# EAGLE design schaltplan (EAGLE 7.7.0)
Schaltplan SensorknotenIoT Arduino Nano
CNAME: SensorknotenIoT Arduino Nano; CREVISION: 2.3; DESIGNER: Jan G. & David P.
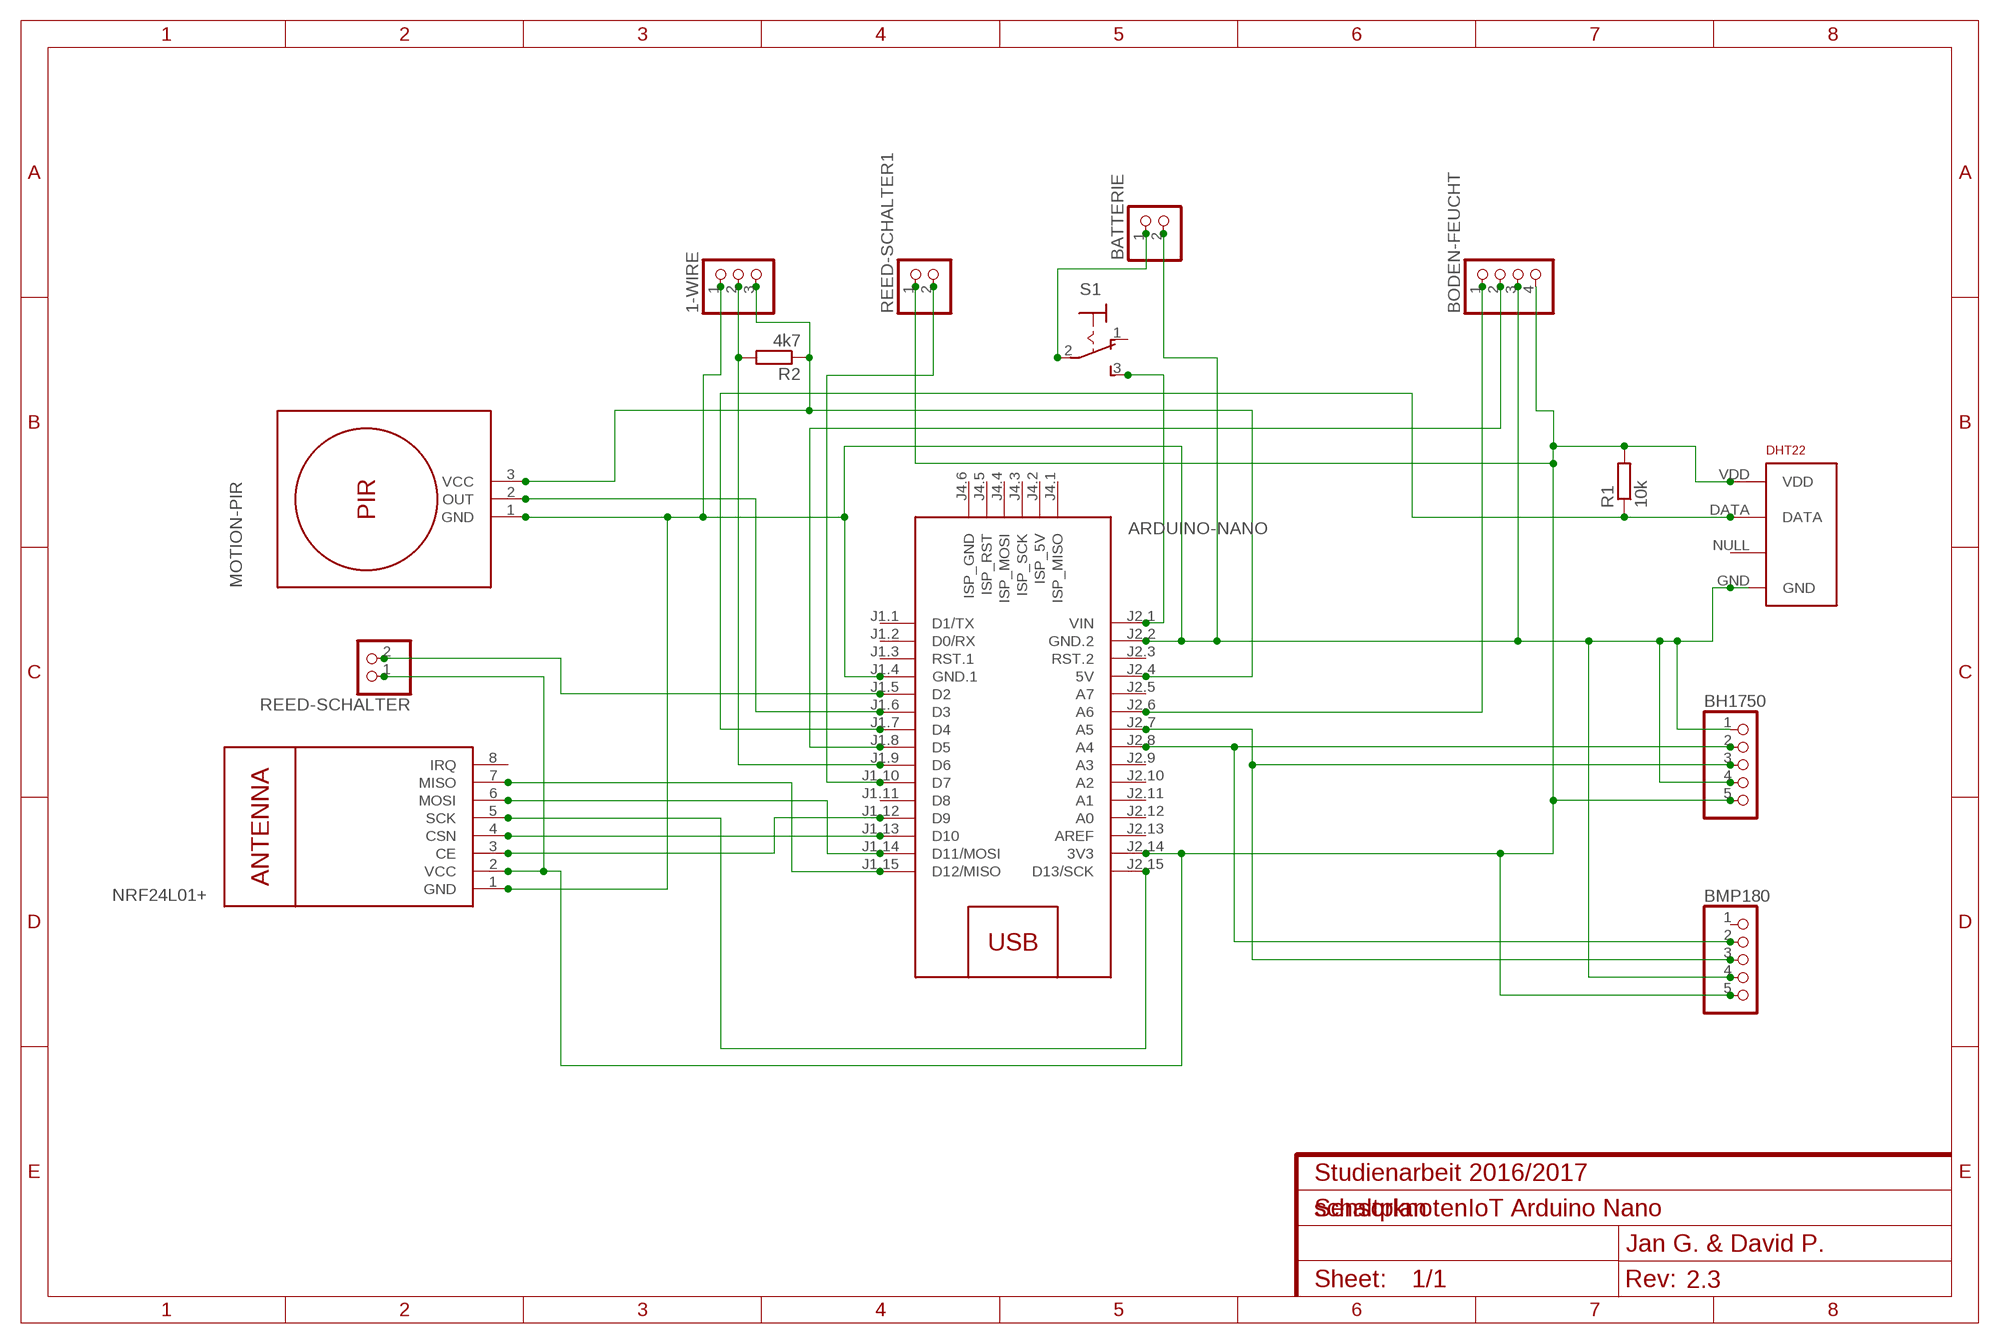
[diagram p0: schematic, sheet 1]

## Parts
1-WIRE  PINHD-1X3  [1X03]
ARDUINO-NANO  ARDUINO-NANO-3.0#ISP  [ARDUINO-NANO-3.0#ISP]
BATTERIE  PINHD-1X2  [1X02]
BH1750  PINHD-1X5  [1X05]
BMP180  PINHD-1X5  [1X05]
BODEN-FEUCHT  PINHD-1X4  [1X04]
DHT22  RHT03_DHT-22_AM2302  [RHT03_DHT-22]
MOTION-PIR  MOTION-PIR-DYP-ME003  [MOTION-PIR-DYP-ME003]
NRF24L01+  WIRELESS-NRF24L01  [WIRELESS-NRF24L01]
R1  10k  R-EU_0207/10  [0207/10]
R2  4k7  R-EU_0207/10  [0207/10]
REED-SCHALTER  PINHD-1X2  [1X02]
REED-SCHALTER1  PINHD-1X2  [1X02]
S1  320-916  [320-916]

## Nets
3.3V: ARDUINO-NANO.J2.14(3V3) BH1750.5 BMP180.5 BODEN-FEUCHT.4 DHT22.VDD NRF24L01+.2(VCC) R1.2 REED-SCHALTER1.1 REED-SCHALTER.1
5V: 1-WIRE.3 ARDUINO-NANO.J2.4(5V) MOTION-PIR.3(VCC) R2.1
GND: 1-WIRE.1 ARDUINO-NANO.J1.4(GND.1) ARDUINO-NANO.J2.2(GND.2) BATTERIE.2 BH1750.1 BH1750.4 BMP180.4 BODEN-FEUCHT.3 DHT22.GND MOTION-PIR.1(GND) NRF24L01+.1(GND)
MISO: ARDUINO-NANO.J1.15(D12/MISO) NRF24L01+.7(MISO)
MOSI: ARDUINO-NANO.J1.14(D11/MOSI) NRF24L01+.6(MOSI)
N$1: ARDUINO-NANO.J1.7(D4) DHT22.DATA R1.1
N$2: ARDUINO-NANO.J1.5(D2) REED-SCHALTER.2
N$3: ARDUINO-NANO.J2.6(A6) BODEN-FEUCHT.1
N$4: ARDUINO-NANO.J1.8(D5) BODEN-FEUCHT.2
N$5: BATTERIE.1 S1.2(P)
N$6: 1-WIRE.2 ARDUINO-NANO.J1.9(D6) R2.2
N$7: ARDUINO-NANO.J1.10(D7) REED-SCHALTER1.2
N$8: ARDUINO-NANO.J1.6(D3) MOTION-PIR.2(OUT)
N$9: ARDUINO-NANO.J1.12(D9) NRF24L01+.3(CE)
N$10: ARDUINO-NANO.J1.13(D10) NRF24L01+.4(CSN)
N$13: ARDUINO-NANO.J2.1(VIN) S1.3(S)
SCK: ARDUINO-NANO.J2.15(D13/SCK) NRF24L01+.5(SCK)
SCL: ARDUINO-NANO.J2.7(A5) BH1750.3 BMP180.3
SDA: ARDUINO-NANO.J2.8(A4) BH1750.2 BMP180.2
Unconnected: ARDUINO-NANO.J1.1(D1/TX) ARDUINO-NANO.J1.2(D0/RX) ARDUINO-NANO.J1.3(RST.1) ARDUINO-NANO.J1.11(D8) ARDUINO-NANO.J2.3(RST.2) ARDUINO-NANO.J2.5(A7) ARDUINO-NANO.J2.9(A3) ARDUINO-NANO.J2.10(A2) ARDUINO-NANO.J2.11(A1) ARDUINO-NANO.J2.12(A0) ARDUINO-NANO.J2.13(AREF) ARDUINO-NANO.J4.1(ISP_MISO) ARDUINO-NANO.J4.2(ISP_5V) ARDUINO-NANO.J4.3(ISP_SCK) ARDUINO-NANO.J4.4(ISP_MOSI) ARDUINO-NANO.J4.5(ISP_RST) ARDUINO-NANO.J4.6(ISP_GND) BMP180.1 DHT22.NULL NRF24L01+.8(IRQ) S1.1(O)

## Notes on the sheet
- Studienarbeit 2016/2017

## Library data of the parts
1-WIRE = pinhead:PINHD-1X3: PIN HEADER
ARDUINO-NANO = diy-modules:ARDUINO-NANO-3.0#ISP: Arduino Nano 3.0 with ISP pads
BATTERIE REED-SCHALTER REED-SCHALTER1 = pinhead:PINHD-1X2: PIN HEADER
BH1750 BMP180 = pinhead:PINHD-1X5: PIN HEADER
BODEN-FEUCHT = pinhead:PINHD-1X4: PIN HEADER
DHT22 = RHT03_DHT-22_AM2302:RHT03_DHT-22_AM2302: RHT03 / DHT-22 / AM2302 Packages and symbol for the RHT03 / DHT-22 relative humidity and temperature sensor. Note: The AM2302 is a wired version of the DHT-22 which typically requires less clearance and is thus provided as a separate package.; PROD_ID: SEN-10167
MOTION-PIR = diy-modules:MOTION-PIR-DYP-ME003: PIR Motion Sensor Module DYP-ME003 based on BISS0001 pyroelectic detector
NRF24L01+ = diy-modules:WIRELESS-NRF24L01: 2.4 GHz Wireless Module based on NRF24L01 chip
R1 R2 = resistor:R-EU_: RESISTOR, European symbol
S1 = switch:320-916: TOGGLE SWITCH distributor RS Components

## Board
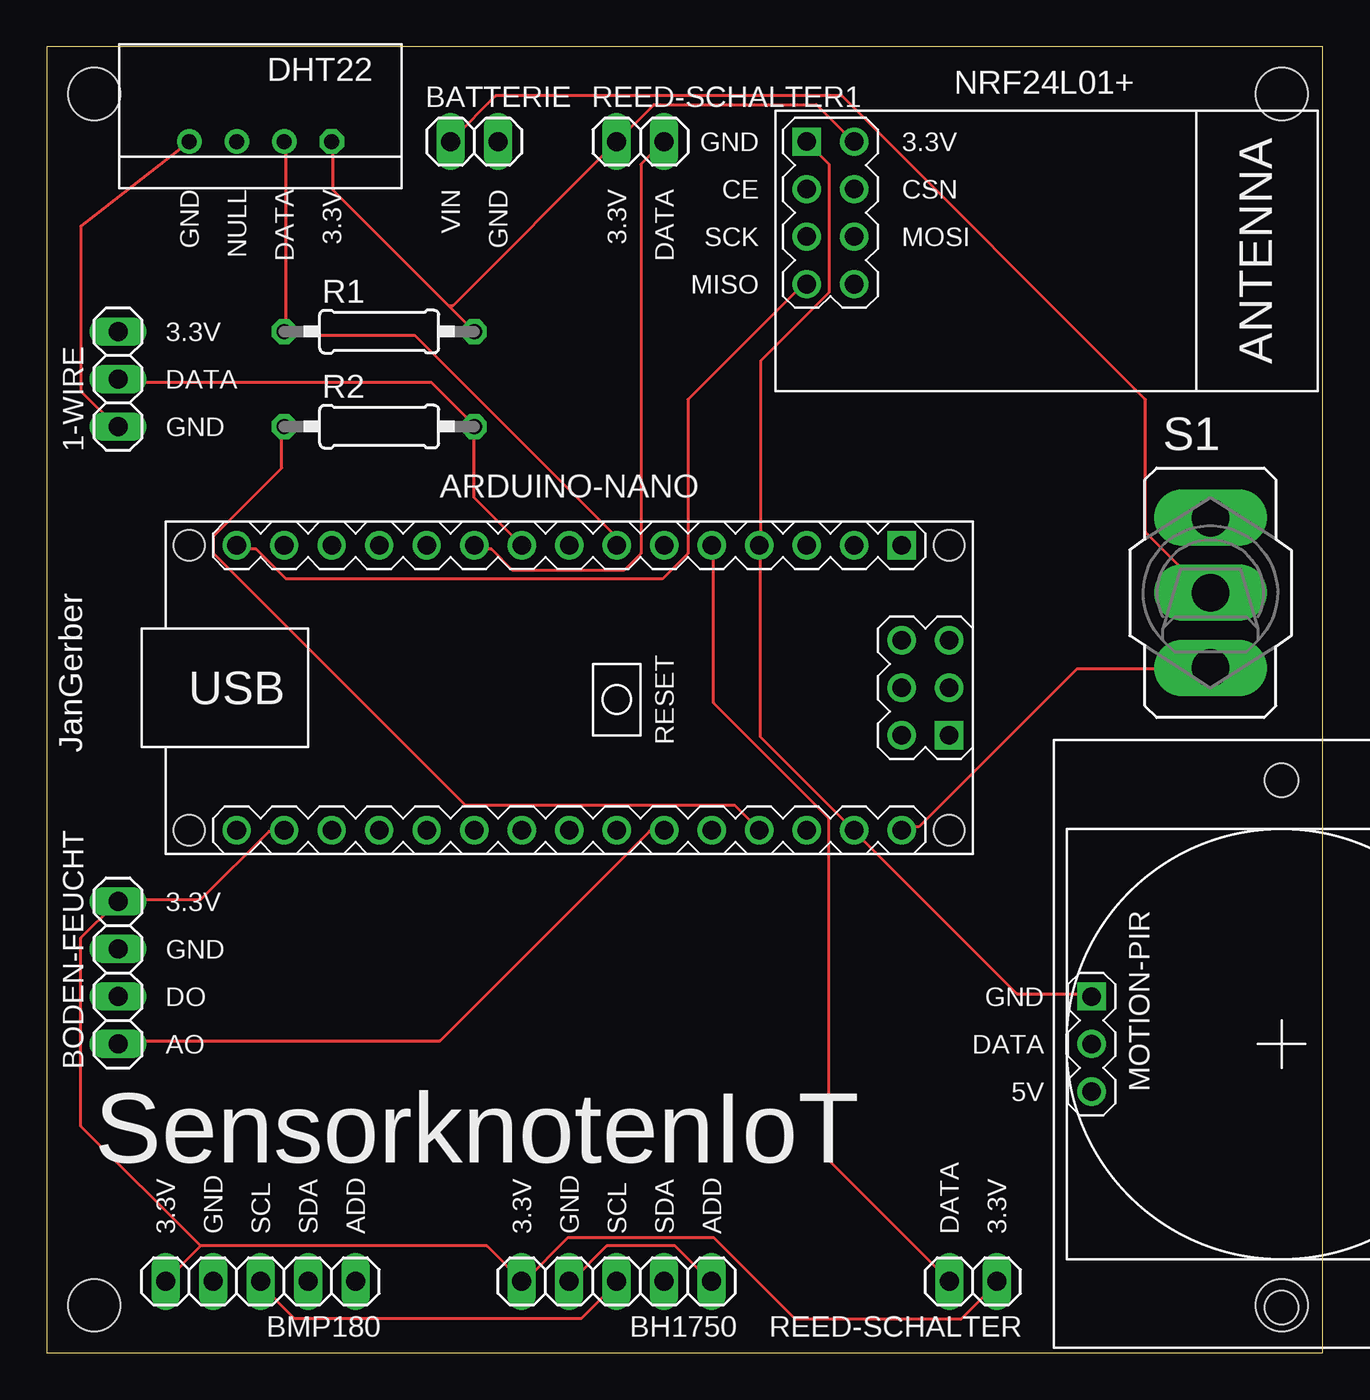
[diagram p1: board, top side]
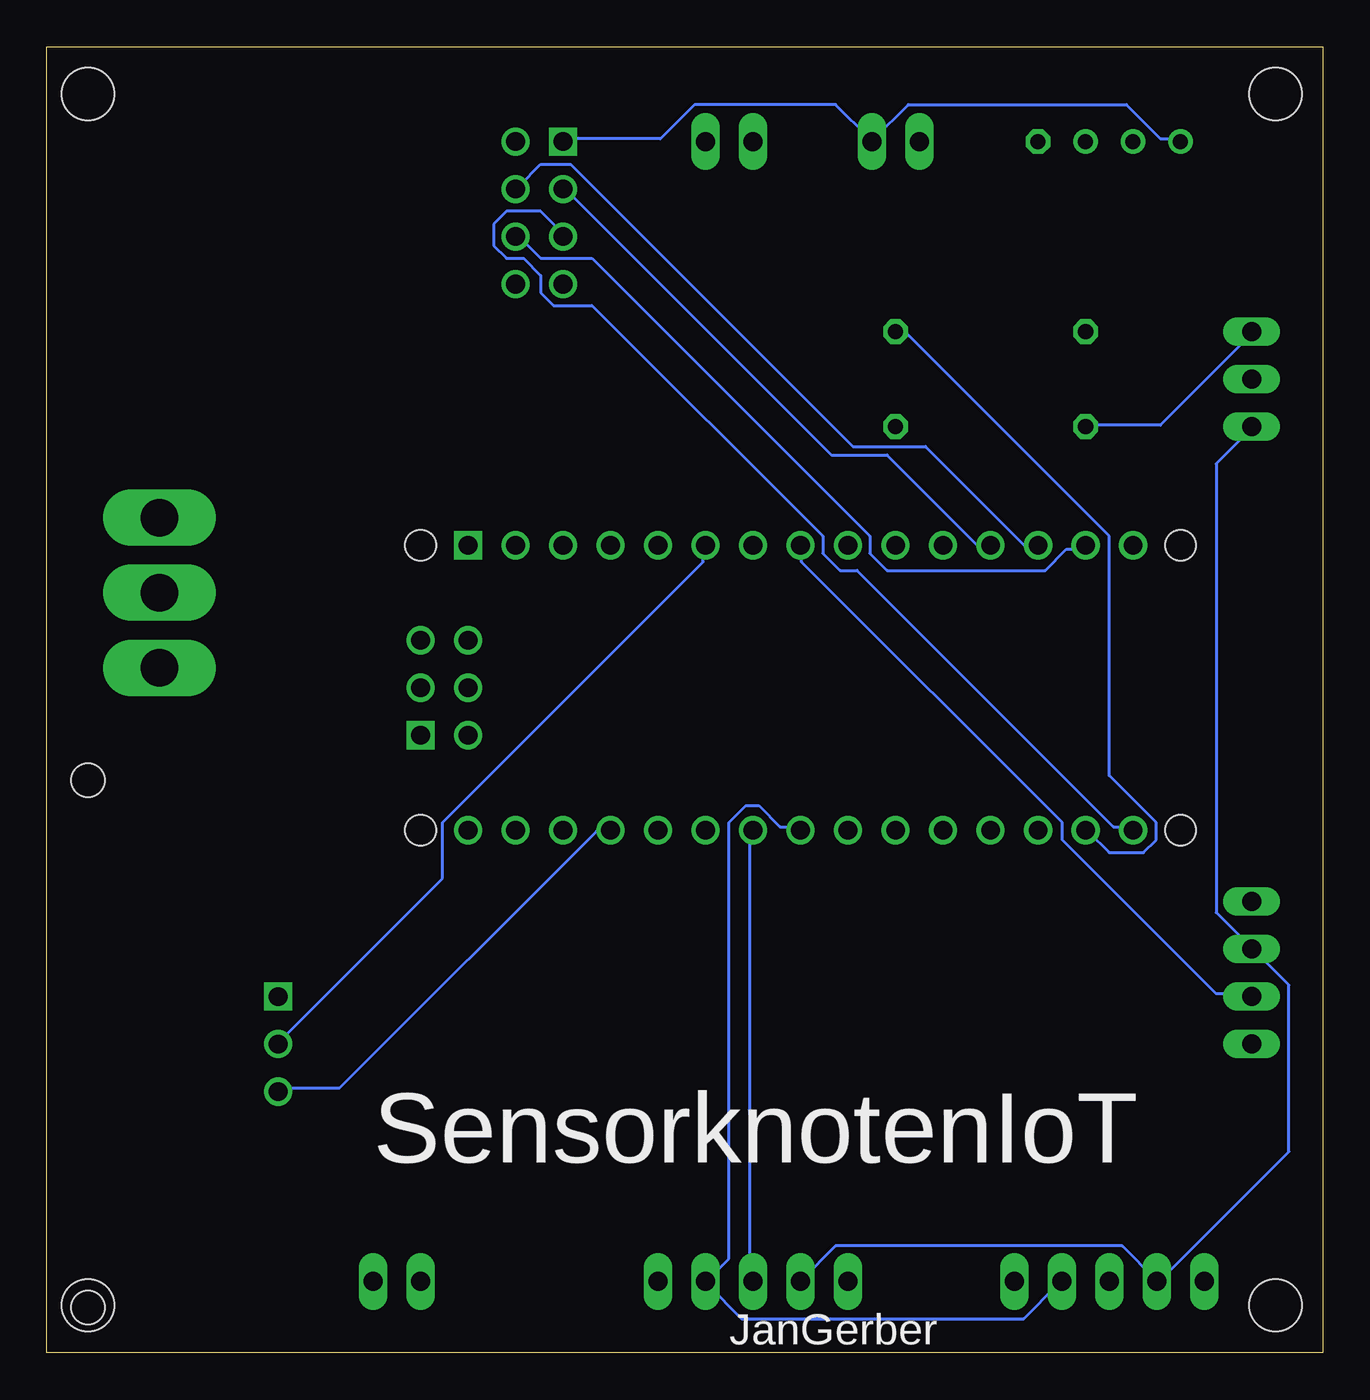
[diagram p2: board, bottom side, seen from below]

Size 68.25 x 69.84 mm. Coordinates in mm from the lower left corner, seen from the top.
Outline: 0,0 68.25,0 68.25,69.84 0,69.84 0,0
Copper layers (1*16): Top 0.035mm / dielectric 1.5mm / Bottom 0.035mm
Design rules "SeeedStudio_2layer_DRU_no_angle_20140221 *": minimum track width 6mil, minimum drill 12mil, track to track 12mil, track to pad 12mil, pad to pad 6mil, via to via 6mil, smd to smd 0mil, copper to edge 10mil, drill to drill 10mil, minimum pad ring 10mil, minimum via ring 6mil, stop-mask expansion 2mil, vias tented up to drill 100mil, thermal gap 10mil
Holes 2.8 mm at 2.54,2.54 66.04,2.54 66.04,67.31 2.54,67.31

### Footprints (pad centres in the part's own frame; a part is rotated, then mirrored left to right if it is on the bottom)
1X03 = drill 1.016 long: 1 -2.54,0; 2 0,0; 3 2.54,0
ARDUINO-NANO-3.0#ISP = drill 1 square: J1.1 17.78,7.62; J4.1 20.32,-2.54 | drill 1: J1.2 15.24,7.62; J1.3 12.7,7.62; J1.4 10.16,7.62; J1.5 7.62,7.62; J1.6 5.08,7.62; J1.7 2.54,7.62; J1.8 0,7.62; J1.9 -2.54,7.62; J1.10 -5.08,7.62; J1.11 -7.62,7.62; J1.12 -10.16,7.62; J1.13 -12.7,7.62; J1.14 -15.24,7.62; J1.15 -17.78,7.62; J2.1 17.78,-7.62; J2.2 15.24,-7.62; J2.3 12.7,-7.62; J2.4 10.16,-7.62; J2.5 7.62,-7.62; J2.6 5.08,-7.62; J2.7 2.54,-7.62; J2.8 0,-7.62; J2.9 -2.54,-7.62; J2.10 -5.08,-7.62; J2.11 -7.62,-7.62; J2.12 -10.16,-7.62; J2.13 -12.7,-7.62; J2.14 -15.24,-7.62; J2.15 -17.78,-7.62; J4.2 17.78,-2.54; J4.3 20.32,0; J4.4 17.78,0; J4.5 20.32,2.54; J4.6 17.78,2.54 | hole 1.651: -20.32,7.62; -20.32,-7.62; 20.32,-7.62; 20.32,7.62
1X02 = drill 1.016 long: 1 -1.27,0; 2 1.27,0
1X05 = drill 1.016 long: 1 -5.08,0; 2 -2.54,0; 3 0,0; 4 2.54,0; 5 5.08,0
1X04 = drill 1.016 long: 1 -3.81,0; 2 -1.27,0; 3 1.27,0; 4 3.81,0
RHT03_DHT-22 = drill 0.8: DATA -1.27,0; GND 3.81,0; NULL 1.27,0 | drill 0.8 octagon: VDD -3.81,0
MOTION-PIR-DYP-ME003 = drill 1 square: 1 -2.54,-10.16 | drill 1: 2 0,-10.16; 3 2.54,-10.16 | hole 1.8: -14.1,0; 14.1,0
WIRELESS-NRF24L01 = drill 1 square: 1 -12.7,6.35 | drill 1: 2 -10.16,6.35; 3 -12.7,3.81; 4 -10.16,3.81; 5 -12.7,1.27; 6 -10.16,1.27; 7 -12.7,-1.27; 8 -10.16,-1.27
0207/10 = drill 0.813 octagon: 1 -5.08,0; 2 5.08,0
320-916 = drill 2.007 long: 1 0,4.013; 2 0,0; 3 0,-4.013

### Placement (x,y rotation side)
1-WIRE  3.81,52.07 90 top
ARDUINO-NANO  27.94,35.56 0 top
BATTERIE  22.86,64.77 0 top
BH1750  30.48,3.81 180 top
BMP180  11.43,3.81 180 top
BODEN-FEUCHT  3.81,20.32 90 top
DHT22  11.43,64.77 180 top
MOTION-PIR  66.04,16.51 270 top
NRF24L01+  53.34,58.42 0 top
R1  17.78,54.61 0 top
R2  17.78,49.53 0 top
REED-SCHALTER  49.53,3.81 180 top
REED-SCHALTER1  31.75,64.77 0 top
S1  62.23,40.64 0 top

### Tracks (layer width: path | path; a pad name or v marks a point on that pad's centre or on a via)
3.3V
  Top 0.152: NRF24L01+.2 42.98,64.92 41.15,66.75 32.46,66.75 REED-SCHALTER1.1 21.72,56.01 21.49,56.01 | 21.49,56.01 22.86,54.63 R1.2 | 21.49,56.01 15.32,62.18 15.32,64.69 DHT22.VDD | ARDUINO-NANO.J2.14 12.57,27.89 11.89,27.89 8.23,24.23 3.89,24.23 BODEN-FEUCHT.4 3.66,24 1.83,22.17 1.83,12.12 8.23,5.71 | 8.23,5.71 6.4,3.89 BMP180.5 | 8.23,5.71 23.55,5.71 25.38,3.89 BH1750.5 25.6,3.89 27.89,6.17 35.66,6.17 40.01,1.83 48.92,1.83 50.75,3.66 REED-SCHALTER.1
  Bottom 0.152: R1.2 22.86,54.41 22.17,54.41 11.43,43.66 11.43,30.86 8.91,28.35 8.91,27.43 9.6,26.75 11.43,26.75 12.57,27.89 ARDUINO-NANO.J2.14
5V
  Top 0.152: R2.1 12.57,49.38 12.57,47.32 8.91,43.66 8.91,42.75 22.4,29.26 36.8,29.26 37.95,28.12 ARDUINO-NANO.J2.4
  Bottom 0.152: R2.1 12.57,49.61 8.69,49.61 3.89,54.41 1-WIRE.3 | ARDUINO-NANO.J2.4 38.18,27.89 38.86,27.89 52.58,14.17 55.78,14.17 MOTION-PIR.3
GND
  Top 0.152: BH1750.4 28.12,3.89 29.95,5.71 33.6,5.71 35.43,3.89 BH1750.1 | MOTION-PIR.1 55.78,19.2 51.89,19.2 43.2,27.89 ARDUINO-NANO.J2.2 42.98,28.12 38.18,32.92 38.18,42.98 ARDUINO-NANO.J1.4 38.18,43.2 38.18,53.03 41.83,56.69 41.83,63.55 40.69,64.69 NRF24L01+.1 | DHT22.GND 1.83,60.25 1.83,51.44 3.66,49.61 1-WIRE.1
  Bottom 0.152: BH1750.4 27.89,3.89 26.06,5.71 10.74,5.71 8.91,3.89 BMP180.4 8.69,3.89 1.83,10.74 1.83,19.66 3.66,21.49 BODEN-FEUCHT.3 3.89,21.72 5.71,23.55 5.71,47.55 3.89,49.38 1-WIRE.1 | DHT22.GND 7.77,64.92 8.69,64.92 10.52,66.75 22.17,66.75 24,64.92 BATTERIE.2 24.23,64.92 26.06,66.75 33.6,66.75 35.43,64.92 40.46,64.92 NRF24L01+.1
MISO
  Top 0.152: ARDUINO-NANO.J1.15 10.29,42.98 11.2,42.98 12.8,41.38 32.92,41.38 34.29,42.75 34.29,50.98 40.46,57.15 NRF24L01+.7
MOSI
  Bottom 0.152: ARDUINO-NANO.J1.14 12.8,42.98 13.72,42.98 14.86,41.83 23.32,41.83 24.23,42.75 24.23,43.66 39.09,58.52 41.83,58.52 42.98,59.66 NRF24L01+.6
N$1
  Top 0.152: DHT22.DATA 12.8,64.69 12.8,54.63 R1.1 12.8,54.41 19.66,54.41 30.4,43.66 30.4,43.2 ARDUINO-NANO.J1.7
N$2
  Top 0.152: ARDUINO-NANO.J1.5 35.66,42.98 35.66,34.75 41.83,28.57 41.83,10.29 48.23,3.89 REED-SCHALTER.2
N$3
  Top 0.152: ARDUINO-NANO.J2.6 32.92,27.89 32.23,27.89 21.03,16.69 3.89,16.69 BODEN-FEUCHT.1
N$4
  Bottom 0.152: ARDUINO-NANO.J1.8 27.89,42.98 27.89,42.29 13.95,28.35 13.95,27.43 5.71,19.2 3.89,19.2 BODEN-FEUCHT.2
N$5
  Top 0.152: BATTERIE.1 21.72,64.92 24,67.21 42.52,67.21 58.75,50.98 58.75,43.89 62.18,40.46 S1.2
N$6
  Top 0.152: ARDUINO-NANO.J1.9 22.86,45.72 R2.2 22.86,49.61 20.57,51.89 3.89,51.89 1-WIRE.2
N$7
  Top 0.152: ARDUINO-NANO.J1.10 22.86,42.98 23.77,42.98 24.92,41.83 30.86,41.83 31.77,42.75 31.77,63.55 32.92,64.69 REED-SCHALTER1.2
N$8
  Bottom 0.152: ARDUINO-NANO.J1.6 33.15,42.98 33.15,42.29 47.09,28.35 47.09,25.38 55.78,16.69 MOTION-PIR.2
N$9
  Bottom 0.152: ARDUINO-NANO.J1.12 17.83,43.2 18.52,43.2 23.32,48.01 26.29,48.01 40.46,62.18 NRF24L01+.3
N$10
  Bottom 0.152: ARDUINO-NANO.J1.13 15.32,43.2 16,43.2 21.26,48.46 25.15,48.46 40.23,63.55 41.83,63.55 42.98,62.41 NRF24L01+.4
N$13
  Top 0.152: ARDUINO-NANO.J2.1 45.72,28.12 46.63,28.12 55.09,36.58 62.18,36.58 S1.3
SCK
  Bottom 0.152: ARDUINO-NANO.J2.15 10.29,28.12 11.2,28.12 24.92,41.83 25.83,41.83 26.75,42.75 26.75,43.66 39.09,56.01 41.15,56.01 41.83,56.69 41.83,57.61 42.75,58.52 43.66,58.52 44.35,59.21 44.35,60.35 43.66,61.04 41.83,61.04 40.69,59.89 NRF24L01+.5
SCL
  Top 0.152: BMP180.3 11.43,3.66 13.26,1.83 28.57,1.83 30.4,3.66 BH1750.3
  Bottom 0.152: ARDUINO-NANO.J2.7 30.63,27.89 30.63,3.89 BH1750.3
SDA
  Bottom 0.152: ARDUINO-NANO.J2.8 28.12,28.12 29.03,28.12 30.18,29.26 30.86,29.26 31.77,28.35 31.77,5.03 32.92,3.89 BH1750.2 32.92,3.66 31.09,1.83 16,1.83 14.17,3.66 BMP180.2

### Text on the board
tPlace: GND | 3.3V | GND | NULL | DATA | 3.3V | VIN | GND | 3.3V | DATA | CE | CSN | SCK | MOSI | MISO | 3.3V | DATA | GND | JanGerber | 3.3V | GND | DO | GND | AO | DATA | 5V | MOTION-PIR | 3.3V | GND | SCL | SDA | ADD | 3.3V | GND | SCL | SDA | ADD | DATA | 3.3V
bPlace: JanGerber
tNames: SensorknotenIoT
bNames: SensorknotenIoT